# Altium schematic sheet 1_MCU.schdoc (part 2 of 2)
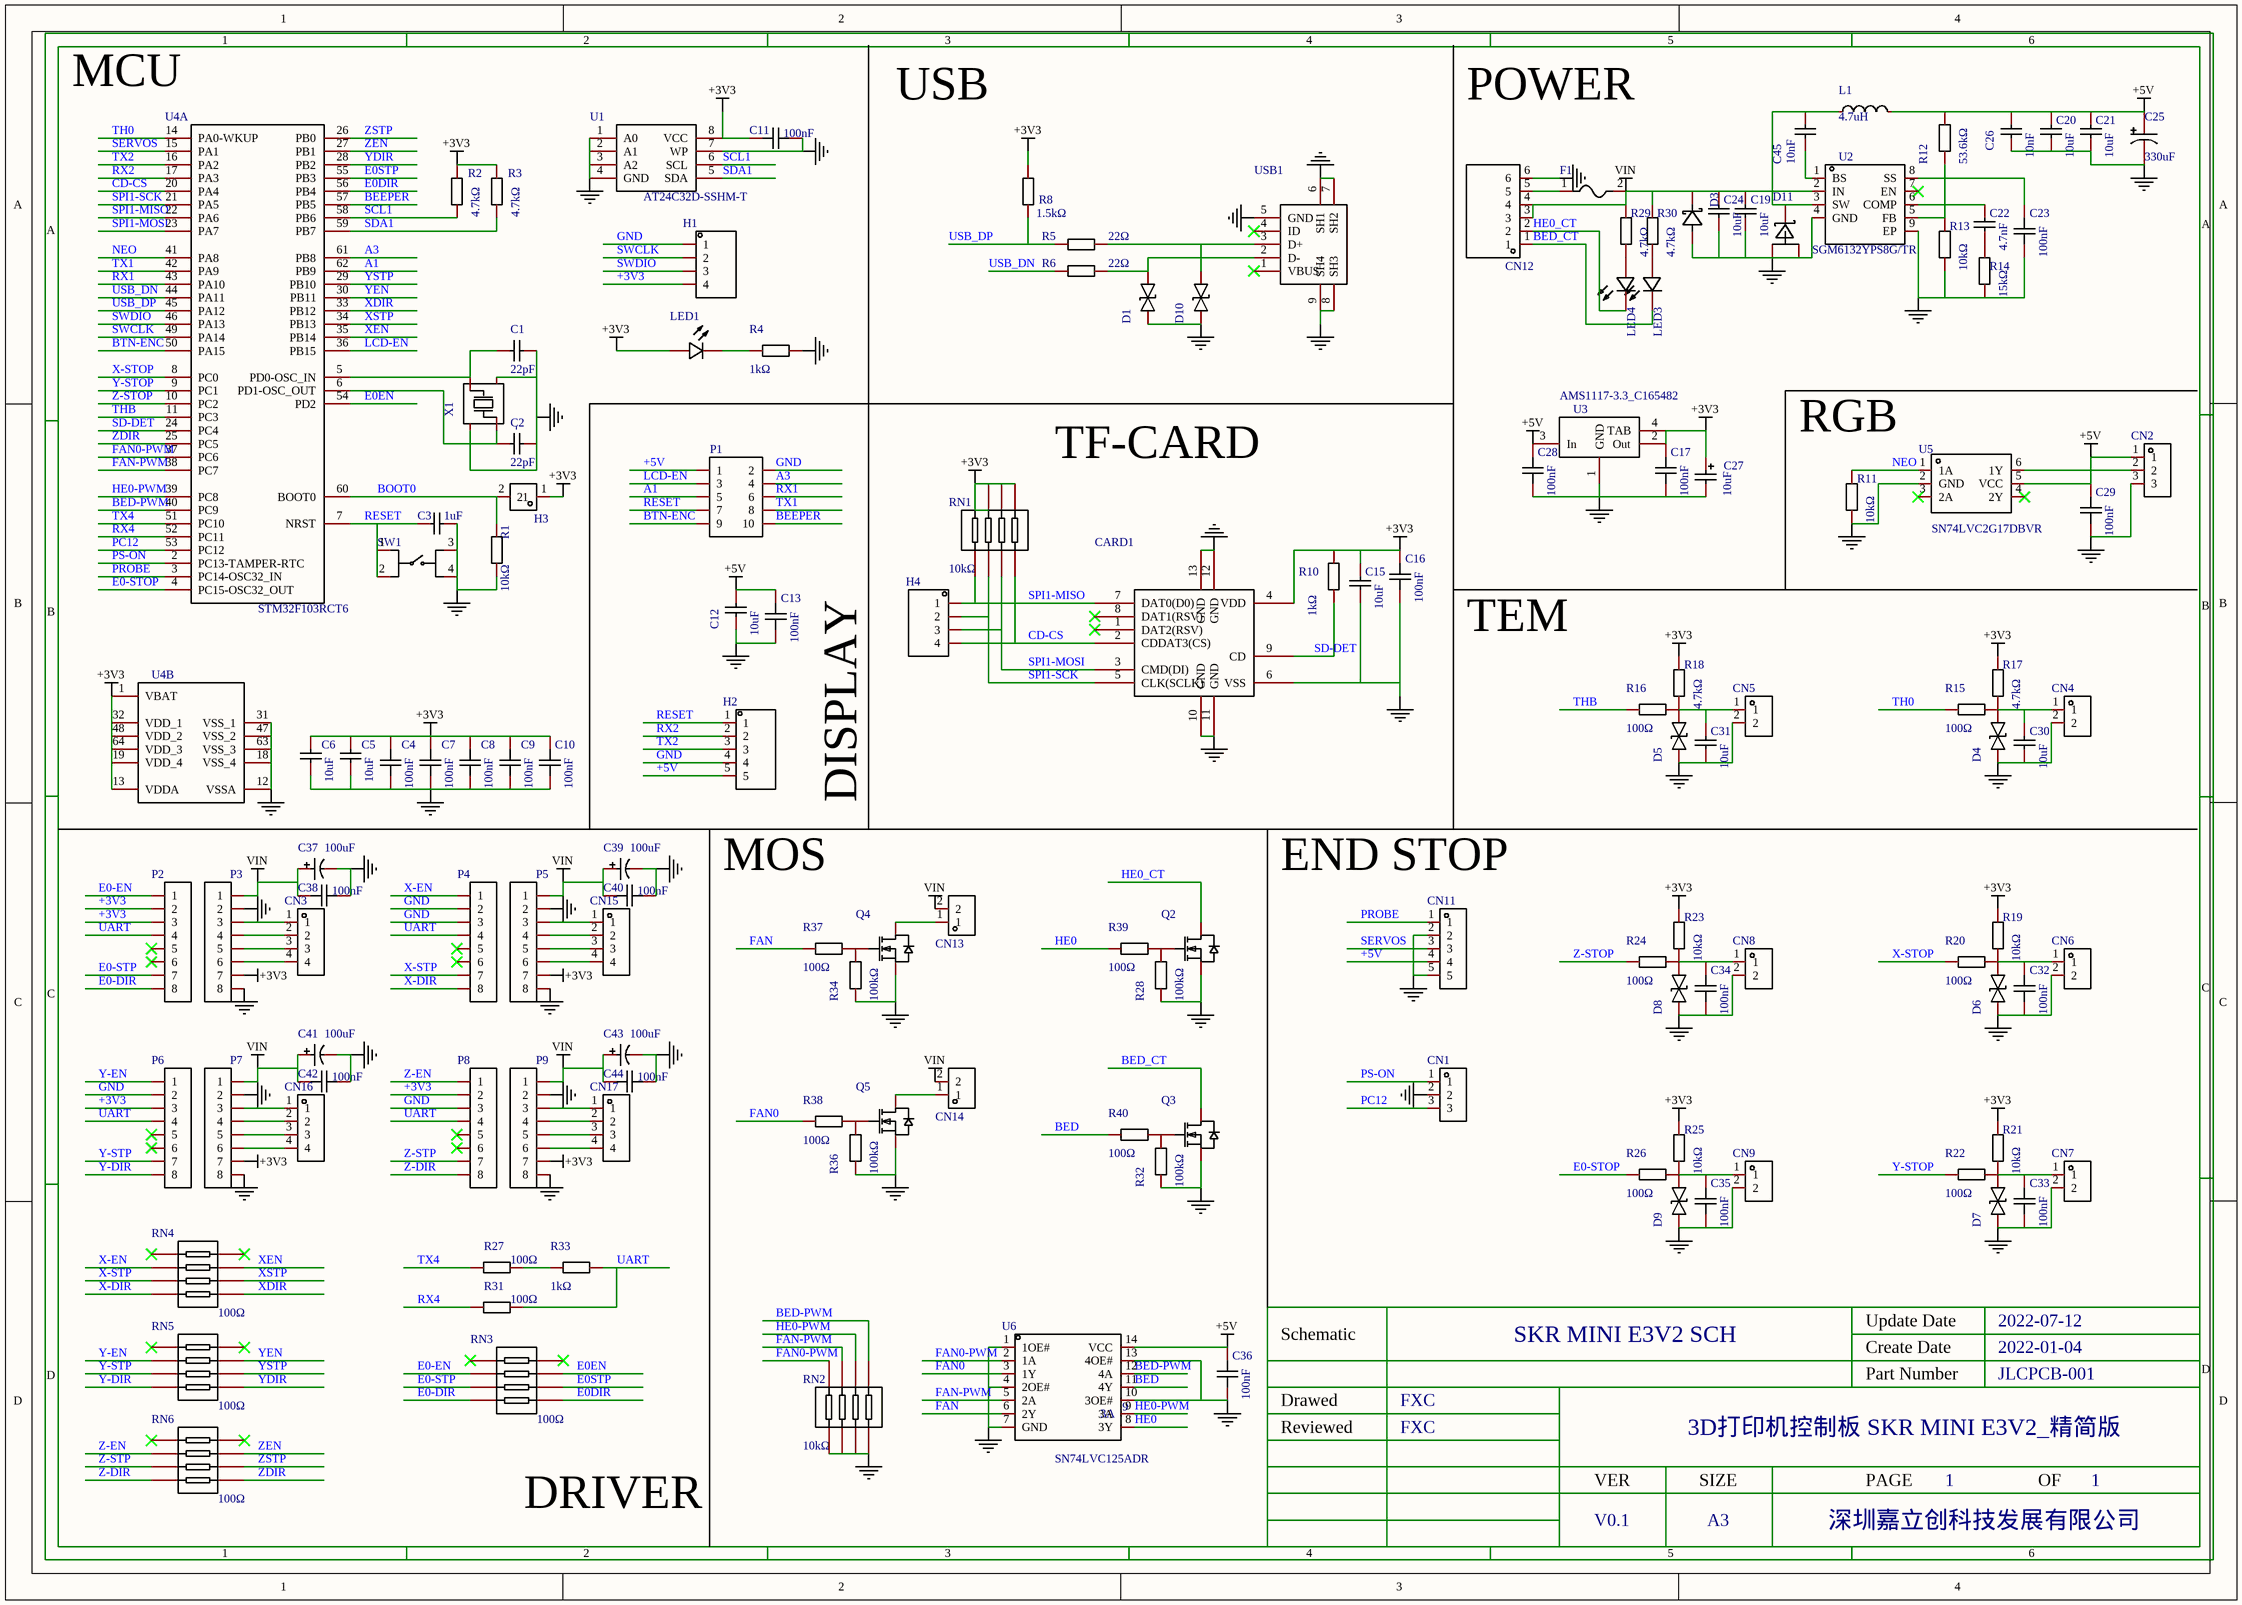
[diagram p1: 1_MCU.schdoc]

## Library data of the parts
C1 C2 = CC0603JRNPO9BN220: 温度系数:NP0;电容体长:-;电容体宽:-;电容体厚度:-;精度:±5%;额定电压:50V;容值:22pF;; Manufacturer: YAGEO(国巨); Add into BOM: yes; Temperature Coefficient: NP0; Tolerance: ±5%; Voltage Rated: 50V; Symbol: CC0603JRNPO9BN220; Device: CC0603JRNPO9BN220; LCSC Part Name: 22pF±5%50V; Supplier Part: C105620; Manufacturer Part: CC0603JRNPO9BN220; LCSC Stock: 146785; LCSC On Sale: 1; Supplier Footprint: 0603; Price: 0.017; JLCPCB Part Class: ExtendedPart; JLCPCB Stock: 85900; JLCPCB On Sale: 1; Datasheet: https://atta.szlcsc.com/upload/public/pdf/source/20170425/1493115771353.pdf; Supplier: LCSC; Convert to PCB: yes; Body Length: -; Body Width: -; Body Thickness: -
C3 = CC0603KRX5R8BB105: 温度系数:X5R;额定电压:25V;电容体长:-;精度:±10%;电容体宽:-;电容体厚度:-;容值:1uF;; Manufacturer: YAGEO(国巨); Add into BOM: yes; Temperature Coefficient: X5R; Voltage Rated: 25V; Tolerance: ±10%; Symbol: CC0603KRX5R8BB105; Device: CC0603KRX5R8BB105; LCSC Part Name: 1uF±10%25V; Supplier Part: C14664; Manufacturer Part: CC0603KRX5R8BB105; LCSC Stock: 429099; LCSC On Sale: 1; Supplier Footprint: 0603; Price: 0.049; JLCPCB Part Class: ExtendedPart; JLCPCB Stock: 193000; JLCPCB On Sale: 1; Datasheet: https://atta.szlcsc.com/upload/public/pdf/source/20160606/1465200209684.pdf; Supplier: LCSC; Convert to PCB: yes; Body Length: -; Body Width: -; Body Thickness: -
C4 C7-C11 C13 C16 C17 C23 C28 C29 C32-C36 C38 C40 C42 C44 = CC0603KRX7R9BB104: 温度系数:X7R;容值:100nF;电容体长:-;精度:±10%;电容体宽:-;电容体厚度:-;额定电压:50V;; Manufacturer: YAGEO(国巨); Add into BOM: yes; Temperature Coefficient: X7R; Tolerance: ±10%; Voltage Rated: 50V; Symbol: CC0603KRX7R9BB104; Device: CC0603KRX7R9BB104; LCSC Part Name: 100nF±10%50V; Supplier Part: C14663; Manufacturer Part: CC0603KRX7R9BB104; LCSC Stock: 5381762; LCSC On Sale: 1; Supplier Footprint: 0603; Price: 0.031; JLCPCB Part Class: BasicPart; JLCPCB Stock: 2888211; JLCPCB On Sale: 1; Datasheet: https://atta.szlcsc.com/upload/public/pdf/source/20170116/1484561234239.pdf; Supplier: LCSC; Convert to PCB: yes; Body Length: -; Body Width: -; Body Thickness: -
C5 C6 C12 C15 C30 C31 = 0603X106K160NT: 温度系数:X5R;精度:±10%;额定电压:16V;容值:10uF;; Manufacturer: FH(风华); Add into BOM: yes; Temperature Coefficient: X5R; Tolerance: ±10%; Voltage Rated: 16V; Symbol: 0603X106K160NT; Device: 0603X106K160NT; LCSC Part Name: 10uF±10%16V; Supplier Part: C70225; Manufacturer Part: 0603X106K160NT; LCSC Stock: 255156; LCSC On Sale: 1; Supplier Footprint: 0603; Price: 0.253; JLCPCB Part Class: ExtendedPart; JLCPCB Stock: 150590; JLCPCB On Sale: 1; Datasheet: https://atta.szlcsc.com/upload/public/pdf/source/20170923/C70225_1506149537616988930.pdf; Supplier: LCSC; Convert to PCB: yes
C19-C21 C24 = GRM32ER71H106KA12L: 温度系数:X7R;精度:±10%;额定电压:50V;容值:10uF;; Manufacturer: muRata(村田); Add into BOM: yes; Temperature Coefficient: X7R; Tolerance: ±10%; Voltage Rated: 50V; Symbol: GRM32ER71H106KA12L; Device: GRM32ER71H106KA12L; LCSC Part Name: 10uF±10%50V; Supplier Part: C77102; Manufacturer Part: GRM32ER71H106KA12L; LCSC Stock: 102218; LCSC On Sale: 1; Supplier Footprint: 1210; Price: 1.521; JLCPCB Part Class: ExtendedPart; JLCPCB Stock: 83241; JLCPCB On Sale: 1; Datasheet: https://atta.szlcsc.com/upload/public/pdf/source/20180326/C77102_8037C40BA93B8DB29FEBF8412E6361B6.pdf; Supplier: LCSC; Convert to PCB: yes
C22 = CC0603KRX7R9BB472: 温度系数:X7R;电容体长:-;精度:±10%;电容体宽:-;容值:4.7nF;电容体厚度:-;额定电压:50V;; Manufacturer: YAGEO(国巨); Add into BOM: yes; Temperature Coefficient: X7R; Tolerance: ±10%; Voltage Rated: 50V; Symbol: CC0603KRX7R9BB472; Device: CC0603KRX7R9BB472; LCSC Part Name: 4.7nF±10%50V; Supplier Part: C106218; Manufacturer Part: CC0603KRX7R9BB472; LCSC Stock: 363614; LCSC On Sale: 1; Supplier Footprint: 0603; Price: 0.015; JLCPCB Part Class: ExtendedPart; JLCPCB Stock: 164900; JLCPCB On Sale: 1; Datasheet: https://atta.szlcsc.com/upload/public/pdf/source/20170425/1493115778527.pdf; Supplier: LCSC; Convert to PCB: yes; Body Length: -; Body Width: -; Body Thickness: -
C25 = VEJ331M1ETR-0810: 等效串联电阻:-;工作温度:-45℃~+105℃;纹波电流:-;工作寿命:2000hrs105℃;容值:330uF;电容体直径:8mm;精度:±20%;额定电压:25V;电容体长度:10mm;; Manufacturer: lelon(台湾立隆); Symbol: VEJ331M1E0810-TRO; Add into BOM: yes; φD: 8mm; Tolerance: ±20%; Rated Voltage: 25V; L: 10mm; Device: VEJ331M1ETR-0810; LCSC Part Name: 330uF25V; Supplier Part: C249647; Manufacturer Part: VEJ331M1ETR-0810; LCSC Stock: 5470; LCSC On Sale: 1; Supplier Footprint: SMD,8x10mm; Price: 0.667; JLCPCB Part Class: ExtendedPart; JLCPCB Stock: 13890; JLCPCB On Sale: 1; Datasheet: https://atta.szlcsc.com/upload/public/pdf/source/20181115/C249647_DC05E09F10491549F0D47C4C176056B6.pdf; Supplier: LCSC; Convert to PCB: yes; Equivalent Series Resistance(ESR): -; Operating Temperature: -45℃~+105℃; Ripple Current: -; Lifetime @ Temp: 2000hrs105℃
C26 C45 = CC0603KRX7R9BB103: 温度系数:X7R;电容体长:-;精度:±10%;电容体宽:-;电容体厚度:-;额定电压:50V;容值:10nF;; Manufacturer: YAGEO(国巨); Add into BOM: yes; Temperature Coefficient: X7R; Tolerance: ±10%; Voltage Rated: 50V; Symbol: CC0603KRX7R9BB103; Device: CC0603KRX7R9BB103; LCSC Part Name: 10nF±10%50V; Supplier Part: C100042; Manufacturer Part: CC0603KRX7R9BB103; LCSC Stock: 4089903; LCSC On Sale: 1; Supplier Footprint: 0603; Price: 0.013; JLCPCB Part Class: ExtendedPart; JLCPCB Stock: 2739600; JLCPCB On Sale: 1; Datasheet: https://atta.szlcsc.com/upload/public/pdf/source/20180326/C100042_E8B0111D51DE3671A0A4A59FBCEFE81C.pdf; Supplier: LCSC; Convert to PCB: yes; Body Length: -; Body Width: -; Body Thickness: -
C27 = TAJB106K016RNJ: 等效串联电阻:2.8Ω100kHz;工作温度:-55℃~+125℃;额定电压:16V;容值:10uF;精度:±10%;; Manufacturer: AVX; Add into BOM: yes; Rated Voltage: 16V; Tolerance: ±10%; Symbol: TAJB106K016RNJ; Device: TAJB106K016RNJ; LCSC Part Name: 10uF±10%16V; Supplier Part: C7193; Manufacturer Part: TAJB106K016RNJ; LCSC Stock: 300868; LCSC On Sale: 1; Supplier Footprint: CASE-B_3528; Price: 1.1; JLCPCB Part Class: ExtendedPart; JLCPCB Stock: 990; JLCPCB On Sale: 1; Datasheet: https://atta.szlcsc.com/upload/public/pdf/source/20160107/1457707748722.pdf; Supplier: LCSC; Convert to PCB: yes; Equivalent Series Resistance(ESR): 2.8Ω100kHz; Operating Temperature: -55℃~+125℃
C37 C39 C41 C43 = DV101M035E077ETR: 容值:100uF;精度:±20%;额定电压:35V;电容体直径:6.3mm;电容体长度:7.7mm;纹波电流:-;等效串联电阻:-;工作寿命:2000hrs@105℃;工作温度:-55℃~+105℃;; Manufacturer: CapXon(台湾丰宾); Symbol: DV101M035E077R; Add into BOM: yes; Tolerance: ±20%; Rated Voltage: 35V; φD: 6.3mm; L: 7.7mm; Device: DV101M035E077ETR; LCSC Part Name: 100uF±20%35V; Supplier Part: C65221; Manufacturer Part: DV101M035E077ETR; LCSC Stock: 13749; LCSC On Sale: 1; Supplier Footprint: SMD,6.3x7.7mm; Price: 0.418; JLCPCB Part Class: ExtendedPart; JLCPCB Stock: 25140; JLCPCB On Sale: 1; Datasheet: https://atta.szlcsc.com/upload/public/pdf/source/20200427/C65221_FAF85CF8D6791DD03CAADBF174E92980.pdf; Supplier: LCSC; Convert to PCB: yes; Ripple Current: -; Equivalent Series Resistance(ESR): -; Lifetime @ Temp: 2000hrs@105℃; Operating Temperature: -55℃~+105℃
CARD1 = TF-01A: 工作温度范围:-;本体最大高度:-;触头镀层:-;连接器类型:卡座;卡类型:MicroSD卡(TF卡);焊接温度(最大值):-;触头材质:-;卡连接方式:自弹式;; Manufacturer: 韩国韩荣; Add into BOM: yes; Connector Type: 卡座; Card Connection Mode: 自弹式; Symbol: TF-01A; Device: TF-01A; LCSC Part Name: TF-01A; Supplier Part: C91145; Manufacturer Part: TF-01A; LCSC Stock: 80786; LCSC On Sale: 1; Supplier Footprint: SMD; Price: 1.017; JLCPCB Part Class: ExtendedPart; JLCPCB Stock: 30365; JLCPCB On Sale: 1; Datasheet: https://atta.szlcsc.com/upload/public/pdf/source/20190322/C91145_63CBD6FB4639A3A3EC6A9721F18AE0FB.pdf; Supplier: LCSC; Convert to PCB: yes; Operating Temperature Range: -; Maximum Body Height: -; Contact Plating: -; Card Type: MicroSD卡(TF卡); Welding Temperature (Max): -; Contact Material: -
CN1 CN2 = HX25003-3A: 系列:-;连接器类型:-;触头类型:-;间距:-;针脚数:-;; Manufacturer: HX(红星); Add into BOM: yes; Symbol: HX25003-3A; Device: HX25003-3A; LCSC Part Name: 母座直插/直针2.5mm3Pin位; Supplier Part: C442300; Manufacturer Part: HX25003-3A; LCSC Stock: 34544; LCSC On Sale: 1; Supplier Footprint: 插件,P=2.5mm; Price: 0.118; JLCPCB Part Class: ExtendedPart; JLCPCB Stock: 29400; JLCPCB On Sale: 1; Datasheet: https://atta.szlcsc.com/upload/public/pdf/source/20191028/C442300_3475A81FD16A5F63BAE06F455B8D4D60.pdf; Supplier: LCSC; Convert to PCB: yes; Series: -; Connector Type: -; Contact Type: -; Pitch: -; Number of Positions: -; Number of Rows: -; Row Spacing: -; Mounting Type: -; Contact Material: -
CN3 CN15-CN17 = HX25003-4A: 系列:-;连接器类型:-;触头类型:-;间距:-;针脚数:-;; Manufacturer: HX(红星); Add into BOM: yes; Symbol: HX25003-4A; Device: HX25003-4A; LCSC Part Name: 母座直插/直针2.5mm4Pin位; Supplier Part: C442301; Manufacturer Part: HX25003-4A; LCSC Stock: 7788; LCSC On Sale: 1; Supplier Footprint: P=2.5mm; Price: 0.155; JLCPCB Part Class: ExtendedPart; JLCPCB Stock: 21990; JLCPCB On Sale: 1; Datasheet: https://atta.szlcsc.com/upload/public/pdf/source/20191028/C442301_3A3D3A554E5F0CBC5D03B496CD495BC6.pdf; Supplier: LCSC; Convert to PCB: yes; Series: -; Connector Type: -; Contact Type: -; Pitch: -; Number of Positions: -; Number of Rows: -; Row Spacing: -; Mounting Type: -; Contact Material: -
CN4-CN9 CN13 CN14 = HX25003-2A: 系列:-;连接器类型:-;触头类型:-;间距:-;针脚数:-;; Manufacturer: HX(红星); Add into BOM: yes; Symbol: HX25003-2A; Device: HX25003-2A; LCSC Part Name: 母座直插/直针2.5mm2Pin位; Supplier Part: C442299; Manufacturer Part: HX25003-2A; LCSC Stock: 13970; LCSC On Sale: 1; Supplier Footprint: 插件,P=2.5mm; Price: 0.08; JLCPCB Part Class: ExtendedPart; JLCPCB Stock: 42600; JLCPCB On Sale: 1; Datasheet: https://atta.szlcsc.com/upload/public/pdf/source/20191028/C442299_791AF061D32404B3CF2743C2F942DF66.pdf; Supplier: LCSC; Convert to PCB: yes; Series: -; Connector Type: -; Contact Type: -; Pitch: -; Number of Positions: -; Number of Rows: -; Row Spacing: -; Mounting Type: -; Contact Material: -
CN11 = HX25003-5A: 系列:-;连接器类型:-;触头类型:-;间距:-;针脚数:-;; Manufacturer: HX(红星); Add into BOM: yes; Symbol: HX25003-5A; Device: HX25003-5A; LCSC Part Name: 母座直插/直针2.5mm5Pin位; Supplier Part: C442302; Manufacturer Part: HX25003-5A; LCSC Stock: 21417; LCSC On Sale: 1; Supplier Footprint: 插件,P=2.5mm; Price: 0.192; JLCPCB Part Class: ExtendedPart; JLCPCB Stock: 10850; JLCPCB On Sale: 1; Datasheet: https://atta.szlcsc.com/upload/public/pdf/source/20191028/C442302_E66AD84792E19526D7353D56EEE1C29F.pdf; Supplier: LCSC; Convert to PCB: yes; Series: -; Connector Type: -; Contact Type: -; Pitch: -; Number of Positions: -; Number of Rows: -; Row Spacing: -; Mounting Type: -; Contact Material: -
CN12 = HB9500M-9.5-6P: 1、栅栏式接线端子2、间距9.5mm3、６PIN4、带盖子; Manufacturer: KANGNEX(康奈克斯电气); Symbol: HB9500-6; Add into BOM: yes; Device: HB9500M-9.5-6P; LCSC Part Name: 带盖板6P9.5mm; Supplier Part: C162699; Manufacturer Part: HB9500M-9.5-6P; LCSC Stock: 1337; LCSC On Sale: 1; Supplier Footprint: P=9.5mm; Price: 1.89; JLCPCB Part Class: ExtendedPart; JLCPCB Stock: 0; JLCPCB On Sale: 1; Datasheet: https://atta.szlcsc.com/upload/public/pdf/source/20191225/C162699_BACA19499DC60557FF249C367C19F580.pdf; Supplier: LCSC; Convert to PCB: yes
D1 D4-D10 = 0402ESDA-05N: 极性:Bidirectional;峰值脉冲电流（10/1000us）:-;箝位电压:50V;击穿电压（最小值）:-;反向关断电压（典型值）:5V;; Manufacturer: BORN伯恩半导体; Add into BOM: yes; Voltage - Clamping (Max) @ Ipp: 50V; Voltage - Reverse Standoff (Typ): 5V; Symbol: 0402ESDA-05N; Device: 0402ESDA-05N; LCSC Part Name: 0402ESDA-05N; Supplier Part: C316049; Manufacturer Part: 0402ESDA-05N; LCSC Stock: 147335; LCSC On Sale: 1; Supplier Footprint: 0402; Price: 0.092; JLCPCB Part Class: ExtendedPart; JLCPCB Stock: 5931; JLCPCB On Sale: 1; Datasheet: https://atta.szlcsc.com/upload/public/pdf/source/20181026/C316049_37ABAC87650F175221BFB473159300DE.pdf; Supplier: LCSC; Convert to PCB: yes; Polarity: Bidirectional; Current - Peak Pulse (10/1000μs): -; Voltage - Breakdown (Min): -
D3 = SMCJ24A_C699044: 反向关断电压（典型值）:-;击穿电压（最小值）:-;箝位电压:-;峰值脉冲电流（10/1000us）:-;极性:-;; Manufacturer: YANGJIE(扬杰); Add into BOM: yes; Symbol: SMCJ24A_C699044; Device: SMCJ24A_C699044; LCSC Part Name: SMCJ24A; Supplier Part: C699044; Manufacturer Part: SMCJ24A; LCSC Stock: 11785; LCSC On Sale: 1; Supplier Footprint: SMC; Price: 0.886; JLCPCB Part Class: ExtendedPart; JLCPCB Stock: 528; JLCPCB On Sale: 1; Datasheet: https://atta.szlcsc.com/upload/public/pdf/source/20200429/C525726_DCD1C21BAB4583F03750F18DFFC78B79.pdf; Supplier: LCSC; Convert to PCB: yes; Voltage - Reverse Standoff (Typ): -; Voltage - Breakdown (Min): -; Voltage - Clamping (Max) @ Ipp: -; Current - Peak Pulse (10/1000μs): -; Polarity: -
D11 = SVM1045V: 直流反向耐压(Vr):45V;平均整流电流(Io):10A;正向压降(Vf):470mV@10A;; Manufacturer: PANJIT(强茂); Add into BOM: yes; Reverse Voltage (Vr): 45V; Average Rectified Current (Io): 10A; Symbol: SVM1045V; Device: SVM1045V; LCSC Part Name: SVM1045V; Supplier Part: C268715; Manufacturer Part: SVM1045V; LCSC Stock: 648; LCSC On Sale: 1; Supplier Footprint: TO-277; Price: 1.351; JLCPCB Part Class: ExtendedPart; JLCPCB Stock: 150; JLCPCB On Sale: 1; Datasheet: https://atta.szlcsc.com/upload/public/pdf/source/20190429/C268715_9DD34DF5DABA171FE4FE9499770536EA.pdf; Supplier: LCSC; Convert to PCB: yes; Forward Voltage (Vf@If): 470mV@10A
F1 = JFC2410-1800TS: 产品:贴片式保险丝;保险丝类型:延时熔断/慢速熔断;额定电流:8A;标称冷电阻:7mΩ;标称电压降:-;分断能力:50A;熔断I²t:235.18;; Manufacturer: JDTfuse集电通; Add into BOM: yes; Current Rating: 8A; Rated Voltage(AC): 250V; Nominal Cold Resistance: 7mΩ; Breaking Capacity @ Rated Voltage: 50A; Melting I²t: 235.18; Symbol: JFC2410-1800TS; Device: JFC2410-1800TS; LCSC Part Name: 8A250V慢断; Supplier Part: C136390; Manufacturer Part: JFC2410-1800TS; LCSC Stock: 1703; LCSC On Sale: 1; Supplier Footprint: SMD; Price: 0.419; JLCPCB Part Class: ExtendedPart; JLCPCB Stock: 667; JLCPCB On Sale: 1; Datasheet: https://atta.szlcsc.com/upload/public/pdf/source/20171023/C136390_15087481200511053524.pdf; Supplier: LCSC; Convert to PCB: yes; Product: 贴片式保险丝; Fuse Type: 延时熔断/慢速熔断; Rated Voltage(DC): -; Nominal Voltage Drop: -; Operating Temperature: -55°C~125°C
H1 H4 = B-2100S04P-A110: 额定电流:-;触头镀层:-;安装类型:直插;圆针/方针:-;额定电压:-;塑高:-;配合针长度:-;排数:1;总PIN位数:4;间距:2.54mm;触头材质:黄铜;行距:-;; Manufacturer: Ckmtw(灿科盟); Symbol: Header-Male-2.54_1x4; Add into BOM: yes; Pitch: 2.54mm; Device: B-2100S04P-A110; LCSC Part Name: 排针1*4P2.54mm直插; Supplier Part: C124378; Manufacturer Part: B-2100S04P-A110; LCSC Stock: 82033; LCSC On Sale: 1; Supplier Footprint: ThroughHole,P=2.54mm; Price: 0.173; JLCPCB Part Class: ExtendedPart; JLCPCB Stock: 17030; JLCPCB On Sale: 1; Datasheet: https://atta.szlcsc.com/upload/public/pdf/source/20170821/C124378_1503303307508901532.pdf; Supplier: LCSC; Convert to PCB: yes; Current Rating (Max): -; Contact Plating: -; Mounting Type: 直插; Circluar Pins/Square Pins: -; Voltage Rating (Max): -; Insulation Height: -; Length of Mating Pin: -; Number of Rows: 1; Number of Pins: 4; Contact Material: 黄铜; Row Spacing: -
H2 = B-2100S05P-A110: 额定电流:-;触头镀层:-;安装类型:直插;圆针/方针:-;额定电压:-;塑高:-;配合针长度:-;排数:1;总PIN位数:5;间距:2.54mm;触头材质:黄铜;行距:-;; Manufacturer: Ckmtw(灿科盟); Symbol: 210S-1*5P L=11.6MMGold-plated black; Add into BOM: yes; Pitch: 2.54mm; Device: B-2100S05P-A110; LCSC Part Name: 1x5P2.54mm; Supplier Part: C124379; Manufacturer Part: B-2100S05P-A110; LCSC Stock: 12887; LCSC On Sale: 1; Supplier Footprint: 插件,P=2.54mm; Price: 0.218; JLCPCB Part Class: ExtendedPart; JLCPCB Stock: 13480; JLCPCB On Sale: 1; Datasheet: https://atta.szlcsc.com/upload/public/pdf/source/20170821/C124379_1503303308004901533.pdf; Supplier: LCSC; Convert to PCB: yes; Current Rating (Max): -; Contact Plating: -; Mounting Type: 直插; Circluar Pins/Square Pins: -; Voltage Rating (Max): -; Insulation Height: -; Length of Mating Pin: -; Number of Rows: 1; Number of Pins: 5; Contact Material: 黄铜; Row Spacing: -
H3 = PH-00218: 间距:2.54mm;总PIN位数:2;排数:1;插针结构:1x2P;行距:-;安装类型:直插;圆针/方针:方针;额定电流:3A;额定电压:-;配合针长度:6mm;塑高:2.5mm;端接针长度:3mm;触头材质:-;工作温度范围:-40℃~+105℃;颜色:黑色;; Manufacturer: Liansheng(连盛); Add into BOM: yes; Pitch: 2.54mm; Pin Structure: 1x2P; Circluar Pins/Square Pins: 方针; Current Rating (Max): 3A; Symbol: PH-00218; Device: PH-00218; LCSC Part Name: 2.54mm1x2P; Supplier Part: C2685144; Manufacturer Part: PH-00218; LCSC Stock: 1463; LCSC On Sale: 1; Supplier Footprint: 插件,P=2.54mm; Price: 0.062; JLCPCB Part Class: ExtendedPart; JLCPCB Stock: 100; JLCPCB On Sale: 1; Datasheet: https://atta.szlcsc.com/upload/public/pdf/source/20210126/C2685144_9D2ED5447695A6A55C879AD7724E979D.pdf; Supplier: LCSC; Convert to PCB: yes; Number of Pins: 2; Number of Rows: 1; Row Spacing: -; Mounting Type: 直插; Voltage Rating (Max): -; Length of Mating Pin: 6mm; Insulation Height: 2.5mm; Length of End Connection Pin: 3mm; Contact Material: -; Operating Temperature Range: -40℃~+105℃; Color: 黑色
L1 = SLO0630H100MTT: 精度:±20%;额定电流:-;直流电阻(DCR):-;电感值:10uH;; Manufacturer: Sunltech(韩国顺磁); Add into BOM: yes; Tolerance: ±20%; Symbol: SLO0630H100MTT; Device: SLO0630H100MTT; LCSC Part Name: 10uH±20%; Supplier Part: C207842; Manufacturer Part: SLO0630H100MTT; LCSC Stock: 51286; LCSC On Sale: 1; Supplier Footprint: SMD; Price: 0.596; JLCPCB Part Class: ExtendedPart; JLCPCB Stock: 940; JLCPCB On Sale: 1; Datasheet: https://atta.szlcsc.com/upload/public/pdf/source/20190925/C207842_F7F7F5797FF3C611BB92394F21C2FEF0.pdf; Supplier: LCSC; Convert to PCB: yes; Length: 7.1mm; Width: 6.6mm; Rated Current: -; Height: 3mm; DC Resistance (DCR): -
LED1 = 19-217/GHC-YR1S2/3T: 照明颜色:翠绿;色温-CCT（K）:-;主波长/色坐标:520~535nm;; Manufacturer: EVERLIGHT(台湾亿光); Add into BOM: yes; Illumination Color: 翠绿; Luminous Intensity (IF=20mA): 112~258mcd; Symbol: 19-217/GHC-YR1S2/3T; Device: 19-217/GHC-YR1S2/3T; LCSC Part Name: 翠绿LED; Supplier Part: C72043; Manufacturer Part: 19-217/GHC-YR1S2/3T; LCSC Stock: 1687973; LCSC On Sale: 1; Supplier Footprint: 0603; Price: 0.254; JLCPCB Part Class: BasicPart; JLCPCB Stock: 65395; JLCPCB On Sale: 1; Datasheet: https://atta.szlcsc.com/upload/public/pdf/source/20160507/1462613613780.pdf; Supplier: LCSC; Convert to PCB: yes; Mounting Type: 表面贴装; Correlated Color Temperature - CCT(K): -; Luminous Flux/Radiant Flux: -; Dominant Wavelength / Coordinate rank: 520~535nm
LED3 LED4 = 19-213/R6W-BP2Q2B/3T: 照明颜色:红色;主波长/色坐标:-;; Manufacturer: EVERLIGHT(台湾亿光); Add into BOM: yes; Illumination Color: 红色; Symbol: 19-213/R6W-BP2Q2B/3T; Device: 19-213/R6W-BP2Q2B/3T; LCSC Part Name: 贴片LED红色; Supplier Part: C181863; Manufacturer Part: 19-213/R6W-BP2Q2B/3T; LCSC Stock: 167765; LCSC On Sale: 1; Supplier Footprint: 0603; Price: 0.209; JLCPCB Part Class: ExtendedPart; JLCPCB Stock: 3216; JLCPCB On Sale: 1; Datasheet: https://atta.szlcsc.com/upload/public/pdf/source/20190903/C181863_6F4238043BB621B28610B278EFA82774.pdf; Supplier: LCSC; Convert to PCB: yes; Mounting Type: 表面贴装; Luminous Intensity (IF=20mA): -; Dominant Wavelength / Coordinate rank: -
P1 = 2.54-2*5P简牛: 连接器类型:简牛座;每排PIN数:5;排数:2;间距:2.54mm;行距:2.54mm;封装形式:直插;触头材质:-;触头镀层:-;; Manufacturer: BOOMELE(博穆精密); Symbol: HDR-IDC-2.54-2X5P; Add into BOM: yes; Connector Type: 简牛座; Pin Number in each Row: 5; Pitch: 2.54mm; Holder Type: 直插; Device: 2.54-2*5P简牛; LCSC Part Name: 2.54mm2*5P直简牛; Supplier Part: C5665; Manufacturer Part: 2.54-2*5P简牛; LCSC Stock: 54190; LCSC On Sale: 1; Supplier Footprint: 插件,P=2.54mm; Price: 0.362; JLCPCB Part Class: ExtendedPart; JLCPCB Stock: 4856; JLCPCB On Sale: 1; Datasheet: https://atta.szlcsc.com/upload/public/pdf/source/20140331/1457707037896.pdf; Supplier: LCSC; Convert to PCB: yes; Number of Rows: 2; Row Spacing: 2.54mm; Contact Material: -; Contact Plating: -
P2-P9 = 2.54-1*8P母环保: 间距:2.54mm;行距:-;触头镀层:-;触头材质:-;安装类型:直插;塑高:-;总孔位数:8;排数:1;; Manufacturer: BOOMELE(博穆精密); Symbol: Header-Female-2.54_1x8; Add into BOM: yes; Pitch: 2.54mm; Number of Holes: 8; Device: 2.54-1*8P母环保; LCSC Part Name: 1x8P2.54mm; Supplier Part: C27438; Manufacturer Part: 2.54-1*8P母环保; LCSC Stock: 23759; LCSC On Sale: 1; Supplier Footprint: 插件,P=2.54mm; Price: 0.452; JLCPCB Part Class: ExtendedPart; JLCPCB Stock: 33585; JLCPCB On Sale: 1; Datasheet: https://atta.szlcsc.com/upload/public/pdf/source/20151109/1457707554453.pdf; Supplier: LCSC; Convert to PCB: yes; Row Spacing: -; Contact Plating: -; Contact Material: -; Mounting Type: 直插; Insulation Height: -; Number of Rows: 1
Q2 Q3 = NCE6050KA: 阈值电压(Vgs(th)@Id):2.5V250μA;连续漏极电流(Id):50A;功率(Pd):85W;导通电阻(RDS(on)@Vgs,Id):20mΩ20A,10V;漏源电压(Vdss):60V;类型:N沟道;; Manufacturer: 无锡新洁能; Add into BOM: yes; Continuous Drain Current (Id): 50A; Power Dissipation (Pd): 85W; Drain Source Voltage (Vdss): 60V; Type: N沟道; Symbol: NCE6050KA; Device: NCE6050KA; LCSC Part Name: NCE6050KA; Supplier Part: C96013; Manufacturer Part: NCE6050KA; LCSC Stock: 21371; LCSC On Sale: 1; Supplier Footprint: TO-252-2(DPAK); Price: 1.532; JLCPCB Part Class: ExtendedPart; JLCPCB Stock: 2; JLCPCB On Sale: 1; Datasheet: https://atta.szlcsc.com/upload/public/pdf/source/20170228/1488267686631.pdf; Supplier: LCSC; Convert to PCB: yes; Gate Threshold Voltage (Vgs(th)@Id): 2.5V250μA; Drain Source On Resistance (RDS(on)@Vgs,Id): 20mΩ20A,10V
Q4 Q5 = AO3400A_C20917: 漏源电压（Vdss）:30V;连续漏极电流（Id）（25°C时）:5.7A;栅源极阈值电压:1.5V@250uA;漏源导通电阻:26.5mΩ@5.7A,10V;最大功率耗散（Ta=25°C）:1.4W;类型:N沟道;; Manufacturer: AOS; Add into BOM: yes; Drain to Source Voltage(Vdss): 30V; Continuous Drain Current (Id) @ 25°C: 5.7A; Power Dissipation-Max (Ta=25°C): 1.4W; FET Type: N沟道; Symbol: AO3400A; Device: AO3400A_C20917; LCSC Part Name: AO3400A; Supplier Part: C20917; Manufacturer Part: AO3400A; LCSC Stock: 0; LCSC On Sale: 1; Supplier Footprint: SOT-23-3L; Price: 0.991; JLCPCB Part Class: BasicPart; JLCPCB Stock: 21937; JLCPCB On Sale: 1; Datasheet: https://atta.szlcsc.com/upload/public/pdf/source/20140107/1457706668533.pdf; Supplier: LCSC; Convert to PCB: yes; Vgs(th) (Max) @ Id: 1.5V@250uA; Rds On (Max) @ Id, Vgs: 26.5mΩ@5.7A,10V
R1 R11 R13 R19 R21 R23 R25 = RC0603FR-0710KL: 精度:±1%;温度系数:±100ppm/℃;阻值:10kΩ;功率:100mW;最大工作电压:75V;工作温度范围:-55℃~+155℃;; Manufacturer: YAGEO(国巨); Add into BOM: yes; Tolerance: ±1%; Power(Watts): 100mW; Overload Voltage (Max): 75V; Symbol: RC0603FR-0710KL; Device: RC0603FR-0710KL; LCSC Part Name: 10kΩ±1%; Supplier Part: C98220; Manufacturer Part: RC0603FR-0710KL; LCSC Stock: 10690989; LCSC On Sale: 1; Supplier Footprint: 0603; Price: 0.008; JLCPCB Part Class: ExtendedPart; JLCPCB Stock: 5235250; JLCPCB On Sale: 1; Datasheet: https://atta.szlcsc.com/upload/public/pdf/source/20170522/1495423494387.pdf; Supplier: LCSC; Convert to PCB: yes; Temperature Coefficient: ±100ppm/℃; Operating Temperature Range: -55℃~+155℃
R2 R3 R17 R18 R29 R30 = RC0603FR-074K7L: 精度:±1%;阻值:4.7kΩ;温度系数:±100ppm/℃;功率:100mW;最大工作电压:75V;工作温度范围:-55℃~+155℃;; Manufacturer: YAGEO(国巨); Add into BOM: yes; Tolerance: ±1%; Power(Watts): 100mW; Overload Voltage (Max): 75V; Symbol: RC0603FR-074K7L; Device: RC0603FR-074K7L; LCSC Part Name: 4.7kΩ±1%; Supplier Part: C99782; Manufacturer Part: RC0603FR-074K7L; LCSC Stock: 1467928; LCSC On Sale: 1; Supplier Footprint: 0603; Price: 0.006; JLCPCB Part Class: ExtendedPart; JLCPCB Stock: 97650; JLCPCB On Sale: 1; Datasheet: https://atta.szlcsc.com/upload/public/pdf/source/20171030/C99782_15093665213961068236.pdf; Supplier: LCSC; Convert to PCB: yes; Temperature Coefficient: ±100ppm/℃; Operating Temperature Range: -55℃~+155℃
R4 R10 R33 = RC0603FR-071KL: 精度:±1%;温度系数:±100ppm/℃;阻值:1kΩ;功率:100mW;最大工作电压:75V;工作温度范围:-55℃~+155℃;; Manufacturer: YAGEO(国巨); Add into BOM: yes; Tolerance: ±1%; Power(Watts): 100mW; Overload Voltage (Max): 75V; Symbol: RC0603FR-071KL; Device: RC0603FR-071KL; LCSC Part Name: 1kΩ±1%; Supplier Part: C22548; Manufacturer Part: RC0603FR-071KL; LCSC Stock: 4153560; LCSC On Sale: 1; Supplier Footprint: 0603; Price: 0.021; JLCPCB Part Class: ExtendedPart; JLCPCB Stock: 0; JLCPCB On Sale: 0; Datasheet: https://atta.szlcsc.com/upload/public/pdf/source/20180312/7BD3618A8B6324EA6280B0497A051AB7.pdf; Supplier: LCSC; Convert to PCB: yes; Temperature Coefficient: ±100ppm/℃; Operating Temperature Range: -55℃~+155℃
R5 R6 = RC0603FR-0722RL: 最大工作电压:75V;工作温度范围:-55℃~+155℃;电阻长:-;精度:±1%;电阻直径:-;电阻高:-;电阻宽:-;电阻类型:厚膜电阻;温度系数:±100ppm/℃;功率:100mW;阻值:22Ω;; Manufacturer: YAGEO(国巨); Add into BOM: yes; Overload Voltage (Max): 75V; Tolerance: ±1%; Power(Watts): 100mW; Symbol: RC0603FR-0722RL; Device: RC0603FR-0722RL; LCSC Part Name: 22Ω±1%; Supplier Part: C107701; Manufacturer Part: RC0603FR-0722RL; LCSC Stock: 106319; LCSC On Sale: 1; Supplier Footprint: 0603; Price: 0.008; JLCPCB Part Class: ExtendedPart; JLCPCB Stock: 74950; JLCPCB On Sale: 1; Datasheet: https://atta.szlcsc.com/upload/public/pdf/source/20170818/C107701_1503051115480895063.pdf; Supplier: LCSC; Convert to PCB: yes; Operating Temperature Range: -55℃~+155℃; Body Length: -; φD: -; Body Height: -; Body Width: -; Type: 厚膜电阻; Temperature Coefficient: ±100ppm/℃
R8 = 0603WAF1501T5E: 阻值:1.5kΩ;精度:±1%;温度系数:±100ppm/℃;功率:1/10W;最大工作电压:75V;工作温度范围:-55℃~+155℃;; Manufacturer: UNI-ROYAL(厚声); Add into BOM: yes; Tolerance: ±1%; Power(Watts): 1/10W; Overload Voltage (Max): 75V; Symbol: 0603WAF1501T5E; Device: 0603WAF1501T5E; LCSC Part Name: 1.5KΩ±1%; Supplier Part: C22843; Manufacturer Part: 0603WAF1501T5E; LCSC Stock: 605477; LCSC On Sale: 1; Supplier Footprint: 0603; Price: 0.034; JLCPCB Part Class: BasicPart; JLCPCB Stock: 44584; JLCPCB On Sale: 1; Datasheet: https://atta.szlcsc.com/upload/public/pdf/source/20170920/C22843_1505887489783980640.pdf; Supplier: LCSC; Convert to PCB: yes; Temperature Coefficient: ±100ppm/℃; Operating Temperature Range: -55℃~+155℃
R12 = 0603WAF5362T5E: 精度:±1%;功率:1/10W;电阻类型:厚膜电阻;最大工作电压:75V;温度系数:±100ppm/℃;工作温度范围:-55℃~+155℃;阻值:53.6kΩ;; Manufacturer: UNI-ROYAL(厚声); Add into BOM: yes; Tolerance: ±1%; Power(Watts): 1/10W; Overload Voltage (Max): 75V; Symbol: 0603WAF5362T5E; Device: 0603WAF5362T5E; LCSC Part Name: 53.6kΩ±1%; Supplier Part: C23074; Manufacturer Part: 0603WAF5362T5E; LCSC Stock: 55340; LCSC On Sale: 1; Supplier Footprint: 0603; Price: 0.02; JLCPCB Part Class: ExtendedPart; JLCPCB Stock: 1962; JLCPCB On Sale: 1; Datasheet: https://atta.szlcsc.com/upload/public/pdf/source/20200306/C422600_1E6D84923E4A46A82E41ADD87F860B5C.pdf; Supplier: LCSC; Convert to PCB: yes; Type: 厚膜电阻; Temperature Coefficient: ±100ppm/℃; Operating Temperature Range: -55℃~+155℃
R14 = AC0603FR-0715KL: 功率:100mW;电阻长:-;精度:±1%;最大工作电压:75V;工作温度范围:-55℃~+155℃;电阻直径:-;电阻高:-;电阻宽:-;阻值:15kΩ;电阻类型:厚膜电阻;温度系数:±100ppm/℃;; Manufacturer: YAGEO(国巨); Add into BOM: yes; Power(Watts): 100mW; Tolerance: ±1%; Overload Voltage (Max): 75V; Symbol: AC0603FR-0715KL; Device: AC0603FR-0715KL; LCSC Part Name: 15kΩ±1%; Supplier Part: C125928; Manufacturer Part: AC0603FR-0715KL; LCSC Stock: 53305; LCSC On Sale: 1; Supplier Footprint: 0603; Price: 0.009; JLCPCB Part Class: ExtendedPart; JLCPCB Stock: 361550; JLCPCB On Sale: 1; Datasheet: https://atta.szlcsc.com/upload/public/pdf/source/20171221/C125928_15138310091971195203.pdf; Supplier: LCSC; Convert to PCB: yes; Body Length: -; Operating Temperature Range: -55℃~+155℃; φD: -; Body Height: -; Body Width: -; Type: 厚膜电阻; Temperature Coefficient: ±100ppm/℃
R15 R16 R20 R22 R24 R26 R27 R31 R37-R40 = RC0603FR-07100RL: 最大工作电压:75V;工作温度范围:-55℃~+155℃;电阻长:-;精度:±1%;电阻直径:-;电阻高:-;电阻宽:-;电阻类型:厚膜电阻;温度系数:±100ppm/℃;阻值:100Ω;功率:100mW;; Manufacturer: YAGEO(国巨); Add into BOM: yes; Overload Voltage (Max): 75V; Tolerance: ±1%; Power(Watts): 100mW; Symbol: RC0603FR-07100RL; Device: RC0603FR-07100RL; LCSC Part Name: 100Ω±1%; Supplier Part: C105588; Manufacturer Part: RC0603FR-07100RL; LCSC Stock: 2325127; LCSC On Sale: 1; Supplier Footprint: 0603; Price: 0.006; JLCPCB Part Class: ExtendedPart; JLCPCB Stock: 50; JLCPCB On Sale: 1; Datasheet: https://atta.szlcsc.com/upload/public/pdf/source/20170428/1493376742308.pdf; Supplier: LCSC; Convert to PCB: yes; Operating Temperature Range: -55℃~+155℃; Body Length: -; φD: -; Body Height: -; Body Width: -; Type: 厚膜电阻; Temperature Coefficient: ±100ppm/℃
R28 R32 R34 R36 = RC0603FR-07100KL: 精度:±1%;阻值:100kΩ;温度系数:±100ppm/℃;功率:100mW;最大工作电压:75V;工作温度范围:-55℃~+155℃;; Manufacturer: YAGEO(国巨); Add into BOM: yes; Tolerance: ±1%; Power(Watts): 100mW; Overload Voltage (Max): 75V; Symbol: RC0603FR-07100KL; Device: RC0603FR-07100KL; LCSC Part Name: 100kΩ±1%; Supplier Part: C14675; Manufacturer Part: RC0603FR-07100KL; LCSC Stock: 1445275; LCSC On Sale: 1; Supplier Footprint: 0603; Price: 0.006; JLCPCB Part Class: ExtendedPart; JLCPCB Stock: 483150; JLCPCB On Sale: 1; Datasheet: https://atta.szlcsc.com/upload/public/pdf/source/20140324/1457707028752.pdf; Supplier: LCSC; Convert to PCB: yes; Temperature Coefficient: ±100ppm/℃; Operating Temperature Range: -55℃~+155℃
RN1 RN2 = YC164-JR-0710KL: 阻值:10kΩ;精度:±5%;单个元件功率:62.5mW;温度系数:±200ppm/℃;电阻器数:4;引脚数:8;; Manufacturer: YAGEO(国巨); Add into BOM: yes; Tolerance: ±5%; Power(Watts): 62.5mW; Number of Resistors: 4; Symbol: YC164-JR-0710KL; Device: YC164-JR-0710KL; LCSC Part Name: 10kΩ±5%0603x4; Supplier Part: C107374; Manufacturer Part: YC164-JR-0710KL; LCSC Stock: 76038; LCSC On Sale: 1; Supplier Footprint: 1206; Price: 0.037; JLCPCB Part Class: ExtendedPart; JLCPCB Stock: 26450; JLCPCB On Sale: 1; Datasheet: https://atta.szlcsc.com/upload/public/pdf/source/20170418/1492506324305.pdf; Supplier: LCSC; Convert to PCB: yes; Temperature Coefficient: ±200ppm/℃; Number of Pins: 8
RN3-RN6 = 4D03WGJ0101T5E: 电阻器数:4;精度:±5%;引脚数:8;电阻长:-;电阻宽:-;阻值:100Ω;单个元件功率:1/16W;电阻高:-;温度系数:±200ppm/℃;; Manufacturer: UNI-ROYAL(厚声); Add into BOM: yes; Number of Resistors: 4; Tolerance: ±5%; Power(Watts): 1/16W; Symbol: 4D03WGJ0101T5E; Device: 4D03WGJ0101T5E; LCSC Part Name: 100Ω±5%; Supplier Part: C25506; Manufacturer Part: 4D03WGJ0101T5E; LCSC Stock: 121554; LCSC On Sale: 1; Supplier Footprint: 1206; Price: 0.071; JLCPCB Part Class: ExtendedPart; JLCPCB Stock: 4949; JLCPCB On Sale: 1; Datasheet: https://atta.szlcsc.com/upload/public/pdf/source/20170615/1497510993674.pdf; Supplier: LCSC; Convert to PCB: yes; Number of Pins: 8; Body Length: -; Body Width: -; Temperature Coefficient: ±200ppm/℃
SW1 = K2-6639SP-C4SC-04: 触点电流:50mA;额定电压(DC):12V;绝缘电阻:100MΩ;电路结构:单刀单掷;安装方式:立贴;按钮形状:圆形按钮;带灯:-;作用力:250gf@±30gf;机械寿命:1000000;工作温度:-25℃~+85℃;开关长度:6mm;开关宽度:6mm;开关高度:5mm;; Manufacturer: 韩国韩荣; Add into BOM: yes; Contact Current: 50mA; Voltage Rating (DC): 12V; Insulation Resistance: 100MΩ; Circuit: 单刀单掷; Mounting Sytle: 立贴; Actuator Style: 圆形按钮; Switch Length: 6mm; Switch Height: 5mm; Symbol: K2-6639SP-C4SC-04; Device: K2-6639SP-C4SC-04; LCSC Part Name: 6*6*5mm轻触按键; Supplier Part: C83206; Manufacturer Part: K2-6639SP-C4SC-04; LCSC Stock: 22702; LCSC On Sale: 1; Supplier Footprint: SMD; Price: 0.209; JLCPCB Part Class: ExtendedPart; JLCPCB Stock: 32180; JLCPCB On Sale: 1; Datasheet: https://atta.szlcsc.com/upload/public/pdf/source/20200721/C707344_FB3B602593668C8FE1542A3F64DDEE0A.pdf; Supplier: LCSC; Convert to PCB: yes; With Lamp: -; Operating Force: 250gf@±30gf; Mechanical Life: 1000000; Operating Temperature: -25℃~+85℃; Switch Width: 6mm
U1 = AT24C32D-SSHM-T: 存储器接口类型:I2C;存储器容量:32Kb(4Kx8);工作电压:1.7V~5.5V;; Manufacturer: MICROCHIP(美国微芯); Add into BOM: yes; Memory Format: EEPROM; Memory Interface: I2C; Symbol: AT24C32D-SSHM-T; Device: AT24C32D-SSHM-T; LCSC Part Name: AT24C32D-SSHM-T; Supplier Part: C60583; Manufacturer Part: AT24C32D-SSHM-T; LCSC Stock: 39893; LCSC On Sale: 1; Supplier Footprint: SOIC-8_150mil; Price: 3.31; JLCPCB Part Class: ExtendedPart; JLCPCB Stock: 1115; JLCPCB On Sale: 1; Datasheet: https://atta.szlcsc.com/upload/public/pdf/source/20151012/1457707446205.pdf; Supplier: LCSC; Convert to PCB: yes; Memory Size: 32Kb(4Kx8); Voltage - Supply: 1.7V~5.5V
U2 = SGM6132YPS8G/TR: 可输出电流:3A;最大输入电压:28.5V;; Manufacturer: SGMICRO(圣邦微); Add into BOM: yes; Voltage - Output (Min/Fixed): 0.8V; Voltage - Output (Max): 22V; Current - Output: 3A; Frequency - Switching: 1.4MHz; Output Type: Adjustable; Number of Outputs: 1; Voltage - Input (Min): 4.5V; Voltage - Input (Max): 28.5V; Topology: Buck; Synchronous Rectifier: No; Function: Step-Dow; Output Configuration: Positive; Symbol: SGM6132YPS8G/TR; Device: SGM6132YPS8G/TR; LCSC Part Name: SGM6132YPS8G/TR; Supplier Part: C87095; Manufacturer Part: SGM6132YPS8G/TR; LCSC Stock: 0; LCSC On Sale: 1; Supplier Footprint: SOIC-8_EP_150mil; Price: 3.25; JLCPCB Part Class: ExtendedPart; JLCPCB Stock: 1286; Datasheet: https://atta.szlcsc.com/upload/public/pdf/source/20170428/1493376828826.pdf; Supplier: LCSC; Convert to PCB: yes
U3 = SK1117-3.3: 输出类型:-;最大输入电压:-;输出电压(固定):-;输出电压(可调):-;压降(max):-;静态电流(Iq):-;; Manufacturer: SHIKUES(时科); Add into BOM: yes; Device: SK1117-3.3; LCSC Part Name: SK1117-3.3; Supplier Part: C165482; Manufacturer Part: SK1117-3.3; LCSC Stock: 4; LCSC On Sale: 1; Supplier Footprint: SOT-223; Price: 0.329; JLCPCB Part Class: ExtendedPart; JLCPCB Stock: 24; Datasheet: https://atta.szlcsc.com/upload/public/pdf/source/20190505/C165482_82C1AFFA508C9159D3B5A1FBC2B4A936.pdf; Supplier: LCSC; Convert to PCB: yes; Output Configuration: -; Output Type: -; Number of Output Channels: -; Enabling feet: -; Voltage - Input (Max): -; Voltage - Output (Fixed): -; Operating Temperature: -; Voltage - Output (adj): -; Voltage Dropout (Max): -; Output Current (Max): -; Quiescent Current (Iq): -; Current - Supply (Max): -; Ripple Rejection (PSRR): -
U4 = STM32F103RCT6: 工作电压:2V~3.6V;主频（MAX):72MHz;; Manufacturer: ST(意法半导体); Add into BOM: yes; UART/USART: 3USART+2UART; SPI: 3; USB Device: 1; PWM: 18; LCD: LCDparallelinterface,8080/6800modes; I2C（SMBUS/PMBUS）: 2; A/D: 16x12bit; D/A: 2x12bit; Program Memory Size: 256KB; RAM Size: 48KB; Speed: 72MHz; Number of I/O: 51; Symbol: STM32F103RCT6; Device: STM32F103RCT6; LCSC Part Name: STM32F103RCT6; Supplier Part: C8323; Manufacturer Part: STM32F103RCT6; LCSC Stock: 5; LCSC On Sale: 1; Supplier Footprint: LQFP-64_10x10x05P; Price: 393.65; JLCPCB Part Class: ExtendedPart; JLCPCB Stock: 0; JLCPCB On Sale: 1; Datasheet: https://atta.szlcsc.com/upload/public/pdf/source/20161130/1480498797345.pdf; Supplier: LCSC; Convert to PCB: yes; Voltage - Supply (Vcc/Vdd): 2V~3.6V; CAN: 1
U5 = SN74LVC2G17DBVR: 逻辑电路的归属系列:74LVC;逻辑类型:缓冲器，非反向;元件数:2;每元件位数:1;; Manufacturer: TI(德州仪器); Add into BOM: yes; Input Type: 施密特触发器; Current - Output High, Low: 32mA、32mA; Output Type: 推挽式; Number of Elements: 2; Number of Bits per Element: 1; Voltage - Supply: 1.65V~5.5V; Symbol: SN74LVC2G17DBVR; Device: SN74LVC2G17DBVR; LCSC Part Name: SN74LVC2G17DBVR; Supplier Part: C10429; Manufacturer Part: SN74LVC2G17DBVR; LCSC Stock: 20886; LCSC On Sale: 1; Supplier Footprint: SOT-23-6; Price: 0.795; JLCPCB Part Class: ExtendedPart; JLCPCB Stock: 2217; Datasheet: https://atta.szlcsc.com/upload/public/pdf/source/20121212/1457706567767.pdf; Supplier: LCSC; Convert to PCB: yes; Operating Temperature: -40℃~+125℃（TA）; Series: 74LVC; Logic Type: 缓冲器，非反向
U6 = SN74LVC125ADR: 逻辑电路的归属系列:74LVC;逻辑类型:缓冲器，非反向;元件数:4;每元件位数:1;; Manufacturer: TI(德州仪器); Add into BOM: yes; Current - Output High, Low: 24mA、24mA; Output Type: 三态; Number of Elements: 4; Number of Bits per Element: 1; Voltage - Supply: 1.65V~3.6V; Symbol: SN74LVC125ADR; Device: SN74LVC125ADR; LCSC Part Name: SN74LVC125ADR; Supplier Part: C7661; Manufacturer Part: SN74LVC125ADR; LCSC Stock: 2975; LCSC On Sale: 1; Supplier Footprint: SOIC-14_150mil; Price: 0.879; JLCPCB Part Class: ExtendedPart; JLCPCB Stock: 5457; Datasheet: https://atta.szlcsc.com/upload/public/pdf/source/20140707/1457707137968.pdf; Supplier: LCSC; Convert to PCB: yes; Input Type: -; Operating Temperature: -40℃~+125℃（TA）; Series: 74LVC; Logic Type: 缓冲器，非反向
USB1 = MicroXNJ: 连接器类型:Micro-B;标准:USB2.0;公母:母座;触点数量:5;端口数量:1;安装方式:卧贴;额定电流-电源:1A;工作温度范围:-20℃~+85℃;; Manufacturer: SHOUHAN(首韩); Add into BOM: yes; Gender: 母座; Number of Contacts: 5; Number of Ports: 1; Current Rating - Power (Max): 1A; Symbol: MICROXNJ; Device: MicroXNJ; LCSC Part Name: Micro-B母座卧贴小牛角有柱卷边编带; Supplier Part: C404969; Manufacturer Part: MicroXNJ; LCSC Stock: 7341; LCSC On Sale: 1; Supplier Footprint: SMD; Price: 0.226; JLCPCB Part Class: ExtendedPart; JLCPCB Stock: 14330; JLCPCB On Sale: 1; Datasheet: https://atta.szlcsc.com/upload/public/pdf/source/20190722/C404969_F527F22D40F2F6F2B0B236E459D2C165.pdf; Supplier: LCSC; Convert to PCB: yes; Connector Type: Micro-B; Standard: USB2.0; Mounting Style: 卧贴; Operating Temperature Range: -20℃~+85℃
X1 = TAXM8M4RDBCCT2T: 频率公差:-;负载电容:-;工作温度:-;晶振类型:-;等效串联电阻(ESR):-;频率:-;频率稳定度:-;; Manufacturer: TAE(雅晶鑫); Add into BOM: yes; Symbol: TAXM8M4RDBCCT2T; Device: TAXM8M4RDBCCT2T; LCSC Part Name: 8MHz10pF±10ppm; Supplier Part: C400090; Manufacturer Part: TAXM8M4RDBCCT2T; LCSC Stock: 16704; LCSC On Sale: 1; Supplier Footprint: SMD3225-4P; Price: 1.166; JLCPCB Part Class: ExtendedPart; JLCPCB Stock: 937; JLCPCB On Sale: 1; Datasheet: https://atta.szlcsc.com/upload/public/pdf/source/20190626/C400090_CF95B89E745AFE4EF2E392EF8AC009D6.pdf; Supplier: LCSC; Convert to PCB: yes; Frequency Tolerance: -; Load Capacitance: -; Operating Temperature: -; Crystal Type: -; Equivalent Series Resistance (ESR): -; Value: -; Frequency Stability: -